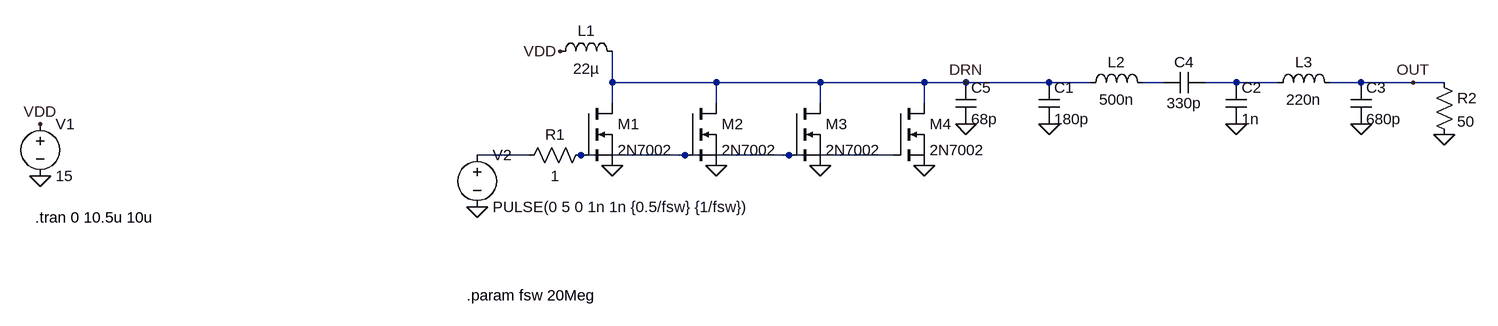
[diagram p0: schematic Buffer Stability.asc]
Buffer Stability.asc, the LTspice schematic file:
Version 4
SHEET 1 3216 11436
WIRE 352 448 352 400
WIRE 512 448 352 448
WIRE 672 448 512 448
WIRE 832 448 672 448
WIRE 896 448 832 448
WIRE 1024 448 896 448
WIRE 1088 448 1024 448
WIRE 1200 448 1168 448
WIRE 1312 448 1264 448
WIRE 1376 448 1312 448
WIRE 1504 448 1456 448
WIRE 1584 448 1504 448
WIRE 1632 448 1584 448
WIRE 352 480 352 448
WIRE 512 480 512 448
WIRE 672 480 672 448
WIRE 832 480 832 448
WIRE 224 560 144 560
WIRE 464 560 304 560
WIRE 624 560 464 560
WIRE 784 560 624 560
FLAG -528 592 0
FLAG -528 512 VDD
FLAG 144 640 0
FLAG 352 576 0
FLAG 272 400 VDD
FLAG 1632 528 0
FLAG 1504 512 0
FLAG 1312 512 0
FLAG 1024 512 0
FLAG 896 448 DRN
FLAG 1584 448 OUT
FLAG 896 512 0
FLAG 512 576 0
FLAG 672 576 0
FLAG 832 576 0
SYMBOL voltage -528 496 R0
WINDOW 123 0 0 Left 0
WINDOW 39 0 0 Left 0
SYMATTR InstName V1
SYMATTR Value 15
SYMBOL voltage 144 544 R0
WINDOW 123 0 0 Left 0
WINDOW 39 0 0 Left 0
SYMATTR InstName V2
SYMATTR Value PULSE(0 5 0 1n 1n {0.5/fsw} {1/fsw})
SYMBOL nmos 304 480 R0
SYMATTR InstName M1
SYMATTR Value 2N7002
SYMBOL res 320 544 R90
WINDOW 0 0 56 VBottom 2
WINDOW 3 32 56 VTop 2
SYMATTR InstName R1
SYMATTR Value 1
SYMBOL ind 256 416 R270
WINDOW 0 32 56 VTop 2
WINDOW 3 5 56 VBottom 2
SYMATTR InstName L1
SYMATTR Value 22µ
SYMBOL cap 1008 448 R0
SYMATTR InstName C1
SYMATTR Value 180p
SYMBOL ind 1072 464 R270
WINDOW 0 32 56 VTop 2
WINDOW 3 5 56 VBottom 2
SYMATTR InstName L2
SYMATTR Value 500n
SYMBOL cap 1296 448 R0
SYMATTR InstName C2
SYMATTR Value 1n
SYMBOL ind 1360 464 R270
WINDOW 0 32 56 VTop 2
WINDOW 3 5 56 VBottom 2
SYMATTR InstName L3
SYMATTR Value 220n
SYMBOL cap 1488 448 R0
SYMATTR InstName C3
SYMATTR Value 680p
SYMBOL res 1616 432 R0
SYMATTR InstName R2
SYMATTR Value 50
SYMBOL cap 1264 432 R90
WINDOW 0 0 32 VBottom 2
WINDOW 3 32 32 VTop 2
SYMATTR InstName C4
SYMATTR Value 330p
SYMBOL cap 880 448 R0
SYMATTR InstName C5
SYMATTR Value 68p
SYMBOL nmos 464 480 R0
SYMATTR InstName M2
SYMATTR Value 2N7002
SYMBOL nmos 624 480 R0
SYMATTR InstName M3
SYMATTR Value 2N7002
SYMBOL nmos 784 480 R0
SYMATTR InstName M4
SYMATTR Value 2N7002
TEXT -536 656 Left 2 !.tran 0 10.5u 10u
TEXT 128 776 Left 2 !.param fsw 20Meg

The netlist it stands for:
* Buffer Stability.asc
V1 VDD 0 15
V2 N003 0 PULSE(0 5 0 1n 1n {0.5/fsw} {1/fsw})
M1 DRN N004 0 0 2N7002
R1 N004 N003 1
L1 VDD DRN 22µ
C1 DRN 0 180p
L2 DRN N001 500n
C2 N002 0 1n
L3 N002 OUT 220n
C3 OUT 0 680p
R2 OUT 0 50
C4 N002 N001 330p
C5 DRN 0 68p
M2 DRN N004 0 0 2N7002
M3 DRN N004 0 0 2N7002
M4 DRN N004 0 0 2N7002
.model NMOS NMOS
.model PMOS PMOS
.lib standard.mos
.tran 0 10.5u 10u
.param fsw 20Meg
.backanno
.end